# EAGLE design sensorboard_eurobotics2010_r2 (EAGLE 4.16)

## Sheet 1 of 2
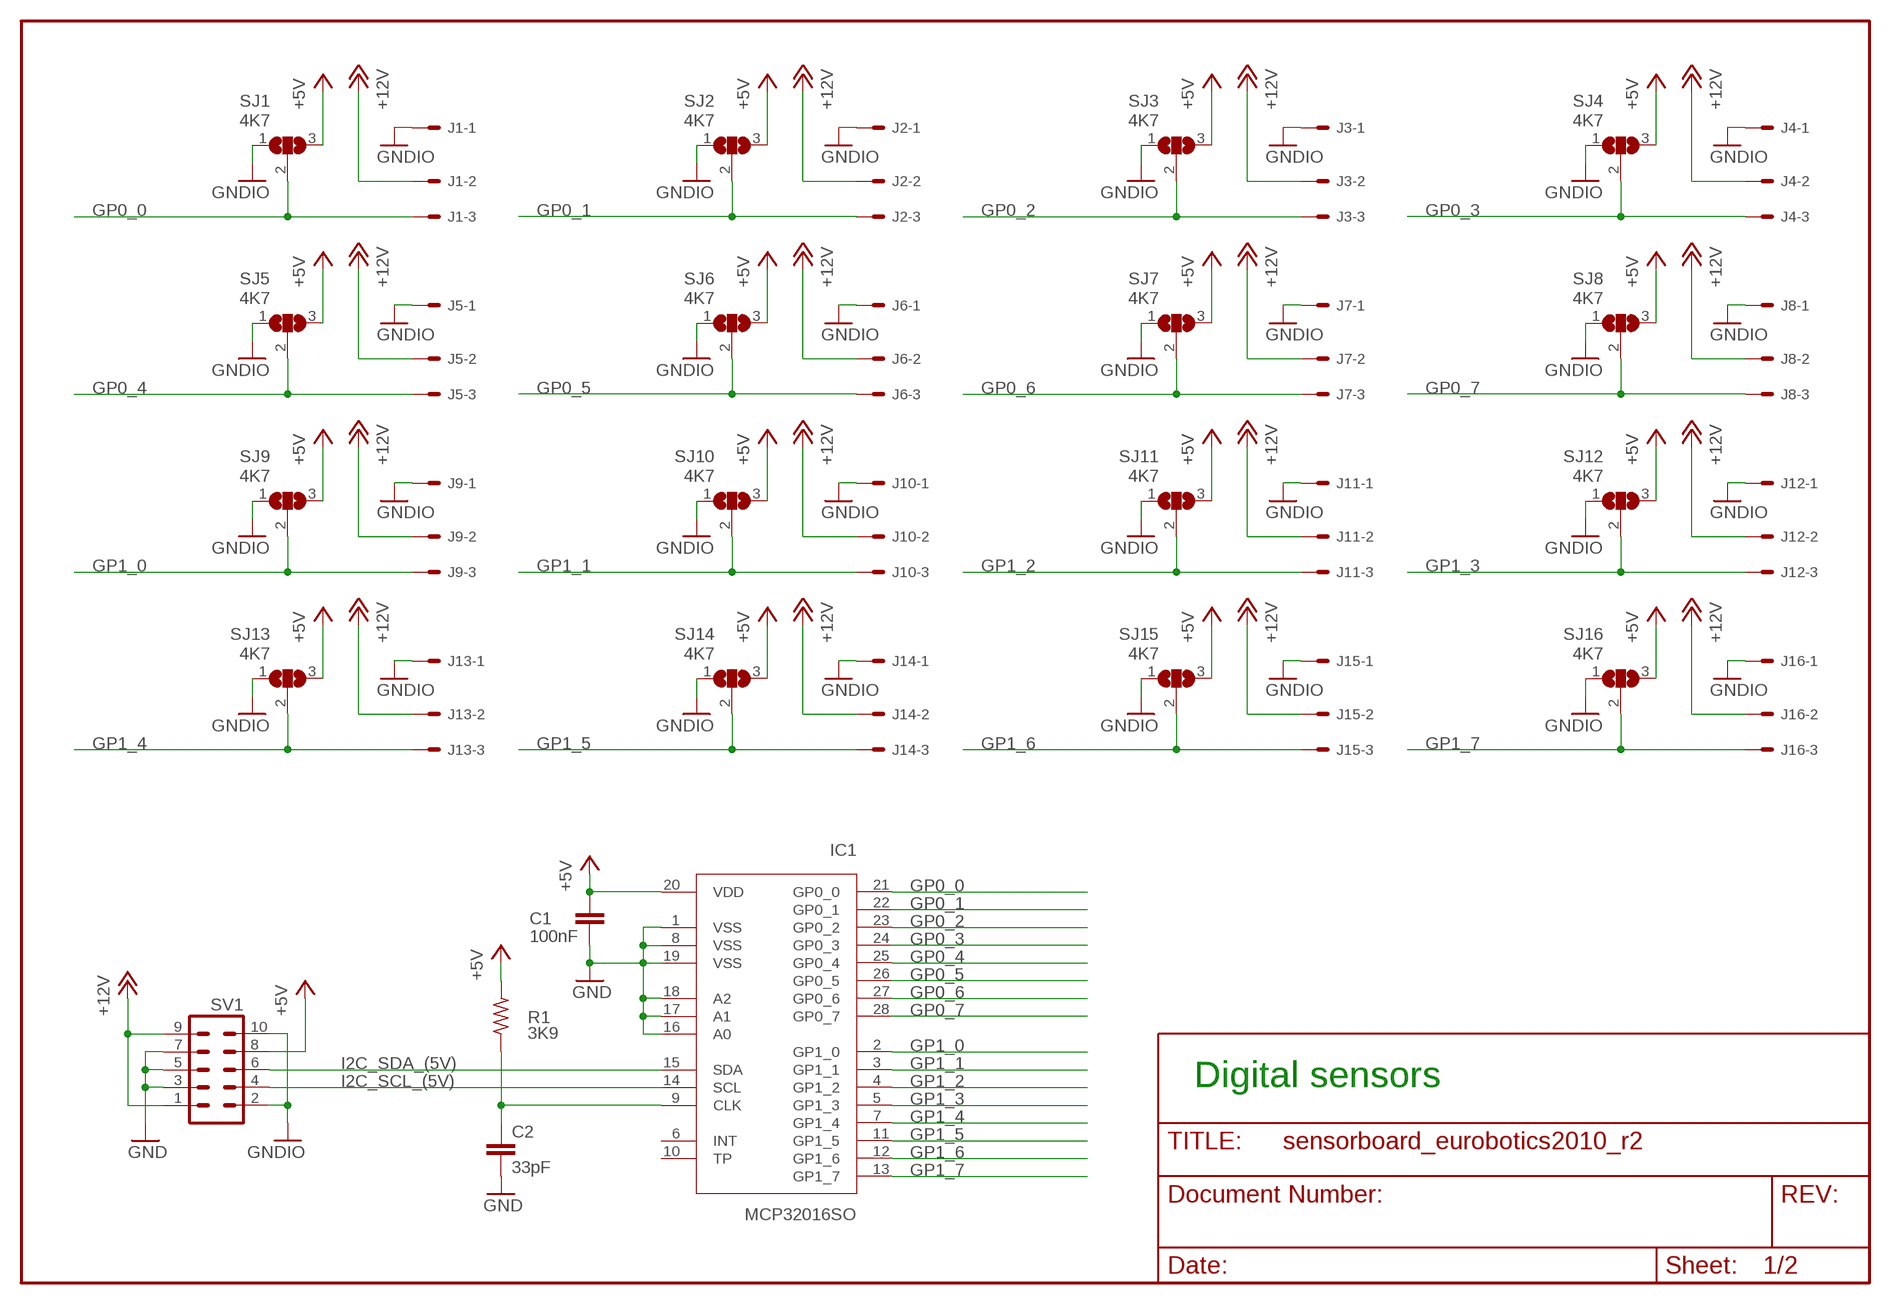
[diagram p0: schematic, sheet 1]

### Parts
C1  100nF  C-EUC0805  [C0805]
C2  33pF  C-EUC0805  [C0805]
IC1  MCP32016SO  [SO-28W]
J1  22-27-2031-03  [6410-03]
J2  22-27-2031-03  [6410-03]
J3  22-27-2031-03  [6410-03]
J4  22-27-2031-03  [6410-03]
J5  22-27-2031-03  [6410-03]
J6  22-27-2031-03  [6410-03]
J7  22-27-2031-03  [6410-03]
J8  22-27-2031-03  [6410-03]
J9  22-27-2031-03  [6410-03]
J10  22-27-2031-03  [6410-03]
J11  22-27-2031-03  [6410-03]
J12  22-27-2031-03  [6410-03]
J13  22-27-2031-03  [6410-03]
J14  22-27-2031-03  [6410-03]
J15  22-27-2031-03  [6410-03]
J16  22-27-2031-03  [6410-03]
R1  3K9  R-US_R0805  [R0805]
SJ1  4K7  SJ2W  [SJ_2]
SJ2  4K7  SJ2W  [SJ_2]
SJ3  4K7  SJ2W  [SJ_2]
SJ4  4K7  SJ2W  [SJ_2]
SJ5  4K7  SJ2W  [SJ_2]
SJ6  4K7  SJ2W  [SJ_2]
SJ7  4K7  SJ2W  [SJ_2]
SJ8  4K7  SJ2W  [SJ_2]
SJ9  4K7  SJ2W  [SJ_2]
SJ10  4K7  SJ2W  [SJ_2]
SJ11  4K7  SJ2W  [SJ_2]
SJ12  4K7  SJ2W  [SJ_2]
SJ13  4K7  SJ2W  [SJ_2]
SJ14  4K7  SJ2W  [SJ_2]
SJ15  4K7  SJ2W  [SJ_2]
SJ16  4K7  SJ2W  [SJ_2]
SV1  ML10  [ML10]

### Nets
+5V: C1.1 IC1.20(VDD) R1.2 SJ1.3 SJ2.3 SJ3.3 SJ4.3 SJ5.3 SJ6.3 SJ7.3 SJ8.3 SJ9.3 SJ10.3 SJ11.3 SJ12.3 SJ13.3 SJ14.3 SJ15.3 SJ16.3 SV1.8 ; also sheet 2
+12V: J1.2 J2.2 J3.2 J4.2 J5.2 J6.2 J7.2 J8.2 J9.2 J10.2 J11.2 J12.2 J13.2 J14.2 J15.2 J16.2 SV1.1 SV1.9 ; also sheet 2
GND: C1.2 C2.2 IC1.1(VSS) IC1.8(VSS) IC1.16(A0) IC1.17(A1) IC1.18(A2) IC1.19(VSS) SV1.3 SV1.5 SV1.7 ; also sheet 2
GNDIO: J1.1 J2.1 J3.1 J4.1 J5.1 J6.1 J7.1 J8.1 J9.1 J10.1 J11.1 J12.1 J13.1 J14.1 J15.1 J16.1 SJ1.1 SJ2.1 SJ3.1 SJ4.1 SJ5.1 SJ6.1 SJ7.1 SJ8.1 SJ9.1 SJ10.1 SJ11.1 SJ12.1 SJ13.1 SJ14.1 SJ15.1 SJ16.1 SV1.2 SV1.10 ; also sheet 2
GP0_0: IC1.21(GP0_0) J1.3 SJ1.2
GP0_1: IC1.22(GP0_1) J2.3 SJ2.2
GP0_2: IC1.23(GP0_2) J3.3 SJ3.2
GP0_3: IC1.24(GP0_3) J4.3 SJ4.2
GP0_4: IC1.25(GP0_4) J5.3 SJ5.2
GP0_5: IC1.26(GP0_5) J6.3 SJ6.2
GP0_6: IC1.27(GP0_6) J7.3 SJ7.2
GP0_7: IC1.28(GP0_7) J8.3 SJ8.2
GP1_0: IC1.2(GP1_0) J9.3 SJ9.2
GP1_1: IC1.3(GP1_1) J10.3 SJ10.2
GP1_2: IC1.4(GP1_2) J11.3 SJ11.2
GP1_3: IC1.5(GP1_3) J12.3 SJ12.2
GP1_4: IC1.7(GP1_4) J13.3 SJ13.2
GP1_5: IC1.11(GP1_5) J14.3 SJ14.2
GP1_6: IC1.12(GP1_6) J15.3 SJ15.2
GP1_7: IC1.13(GP1_7) J16.3 SJ16.2
I2C_SCL_(5V): IC1.14(SCL) SV1.4 ; also sheet 2
I2C_SDA_(5V): IC1.15(SDA) SV1.6 ; also sheet 2
N$63: C2.1 IC1.9(CLK) R1.1
Unconnected: IC1.6(INT) IC1.10(TP)

### Notes on the sheet
- Digital sensors

## Sheet 2 of 2
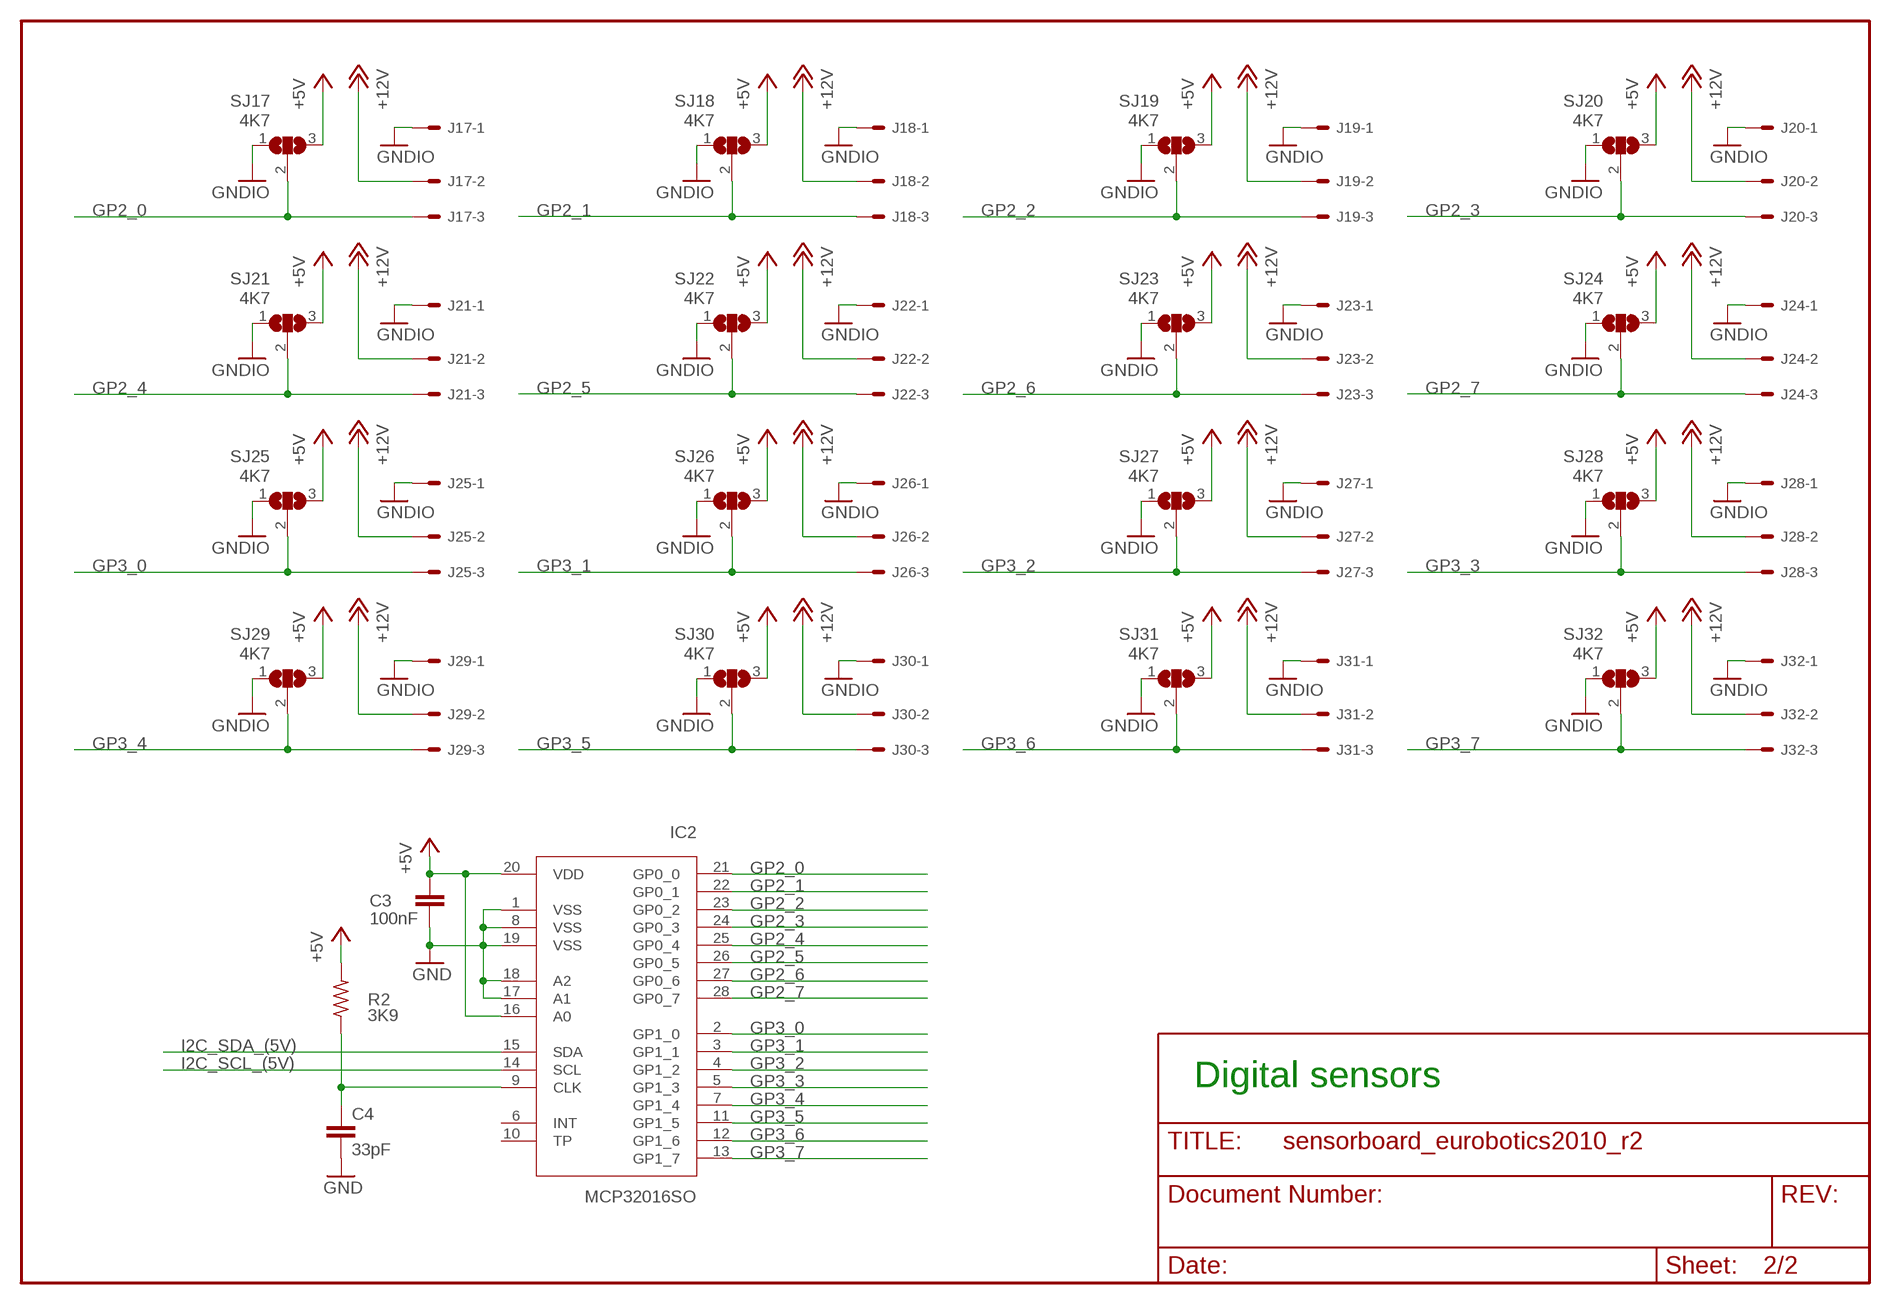
[diagram p1: schematic, sheet 2]

### Parts
C3  100nF  C-EUC0805  [C0805]
C4  33pF  C-EUC0805  [C0805]
IC2  MCP32016SO  [SO-28W]
J17  22-27-2031-03  [6410-03]
J18  22-27-2031-03  [6410-03]
J19  22-27-2031-03  [6410-03]
J20  22-27-2031-03  [6410-03]
J21  22-27-2031-03  [6410-03]
J22  22-27-2031-03  [6410-03]
J23  22-27-2031-03  [6410-03]
J24  22-27-2031-03  [6410-03]
J25  22-27-2031-03  [6410-03]
J26  22-27-2031-03  [6410-03]
J27  22-27-2031-03  [6410-03]
J28  22-27-2031-03  [6410-03]
J29  22-27-2031-03  [6410-03]
J30  22-27-2031-03  [6410-03]
J31  22-27-2031-03  [6410-03]
J32  22-27-2031-03  [6410-03]
R2  3K9  R-US_R0805  [R0805]
SJ17  4K7  SJ2W  [SJ_2]
SJ18  4K7  SJ2W  [SJ_2]
SJ19  4K7  SJ2W  [SJ_2]
SJ20  4K7  SJ2W  [SJ_2]
SJ21  4K7  SJ2W  [SJ_2]
SJ22  4K7  SJ2W  [SJ_2]
SJ23  4K7  SJ2W  [SJ_2]
SJ24  4K7  SJ2W  [SJ_2]
SJ25  4K7  SJ2W  [SJ_2]
SJ26  4K7  SJ2W  [SJ_2]
SJ27  4K7  SJ2W  [SJ_2]
SJ28  4K7  SJ2W  [SJ_2]
SJ29  4K7  SJ2W  [SJ_2]
SJ30  4K7  SJ2W  [SJ_2]
SJ31  4K7  SJ2W  [SJ_2]
SJ32  4K7  SJ2W  [SJ_2]

### Nets
+5V: C3.1 IC2.16(A0) IC2.20(VDD) R2.2 SJ17.3 SJ18.3 SJ19.3 SJ20.3 SJ21.3 SJ22.3 SJ23.3 SJ24.3 SJ25.3 SJ26.3 SJ27.3 SJ28.3 SJ29.3 SJ30.3 SJ31.3 SJ32.3 ; also sheet 1
+12V: J17.2 J18.2 J19.2 J20.2 J21.2 J22.2 J23.2 J24.2 J25.2 J26.2 J27.2 J28.2 J29.2 J30.2 J31.2 J32.2 ; also sheet 1
GND: C3.2 C4.2 IC2.1(VSS) IC2.8(VSS) IC2.17(A1) IC2.18(A2) IC2.19(VSS) ; also sheet 1
GNDIO: J17.1 J18.1 J19.1 J20.1 J21.1 J22.1 J23.1 J24.1 J25.1 J26.1 J27.1 J28.1 J29.1 J30.1 J31.1 J32.1 SJ17.1 SJ18.1 SJ19.1 SJ20.1 SJ21.1 SJ22.1 SJ23.1 SJ24.1 SJ25.1 SJ26.1 SJ27.1 SJ28.1 SJ29.1 SJ30.1 SJ31.1 SJ32.1 ; also sheet 1
GP2_0: IC2.21(GP0_0) J17.3 SJ17.2
GP2_1: IC2.22(GP0_1) J18.3 SJ18.2
GP2_2: IC2.23(GP0_2) J19.3 SJ19.2
GP2_3: IC2.24(GP0_3) J20.3 SJ20.2
GP2_4: IC2.25(GP0_4) J21.3 SJ21.2
GP2_5: IC2.26(GP0_5) J22.3 SJ22.2
GP2_6: IC2.27(GP0_6) J23.3 SJ23.2
GP2_7: IC2.28(GP0_7) J24.3 SJ24.2
GP3_0: IC2.2(GP1_0) J25.3 SJ25.2
GP3_1: IC2.3(GP1_1) J26.3 SJ26.2
GP3_2: IC2.4(GP1_2) J27.3 SJ27.2
GP3_3: IC2.5(GP1_3) J28.3 SJ28.2
GP3_4: IC2.7(GP1_4) J29.3 SJ29.2
GP3_5: IC2.11(GP1_5) J30.3 SJ30.2
GP3_6: IC2.12(GP1_6) J31.3 SJ31.2
GP3_7: IC2.13(GP1_7) J32.3 SJ32.2
I2C_SCL_(5V): IC2.14(SCL) ; also sheet 1
I2C_SDA_(5V): IC2.15(SDA) ; also sheet 1
N$2: C4.1 IC2.9(CLK) R2.1
Unconnected: IC2.6(INT) IC2.10(TP)

### Notes on the sheet
- Digital sensors

## Library data of the parts
C1-C4 = rcl:C-EU: CAPACITOR, European symbol
IC1 IC2 = eagle_jbs_lib:MCP32016: 16-Bit I2C I/O Expander
J1-J32 = con-molex:22-?-03: CONNECTOR wire to board 2.54 mm (.1 inch) pitch header
R1 R2 = rcl:R-US_: RESISTOR, American symbol
SJ1-SJ32 = jumper:SJ2W: SMD solder JUMPER
SV1 = con-harting-ml:ML10: HARTING

## Board
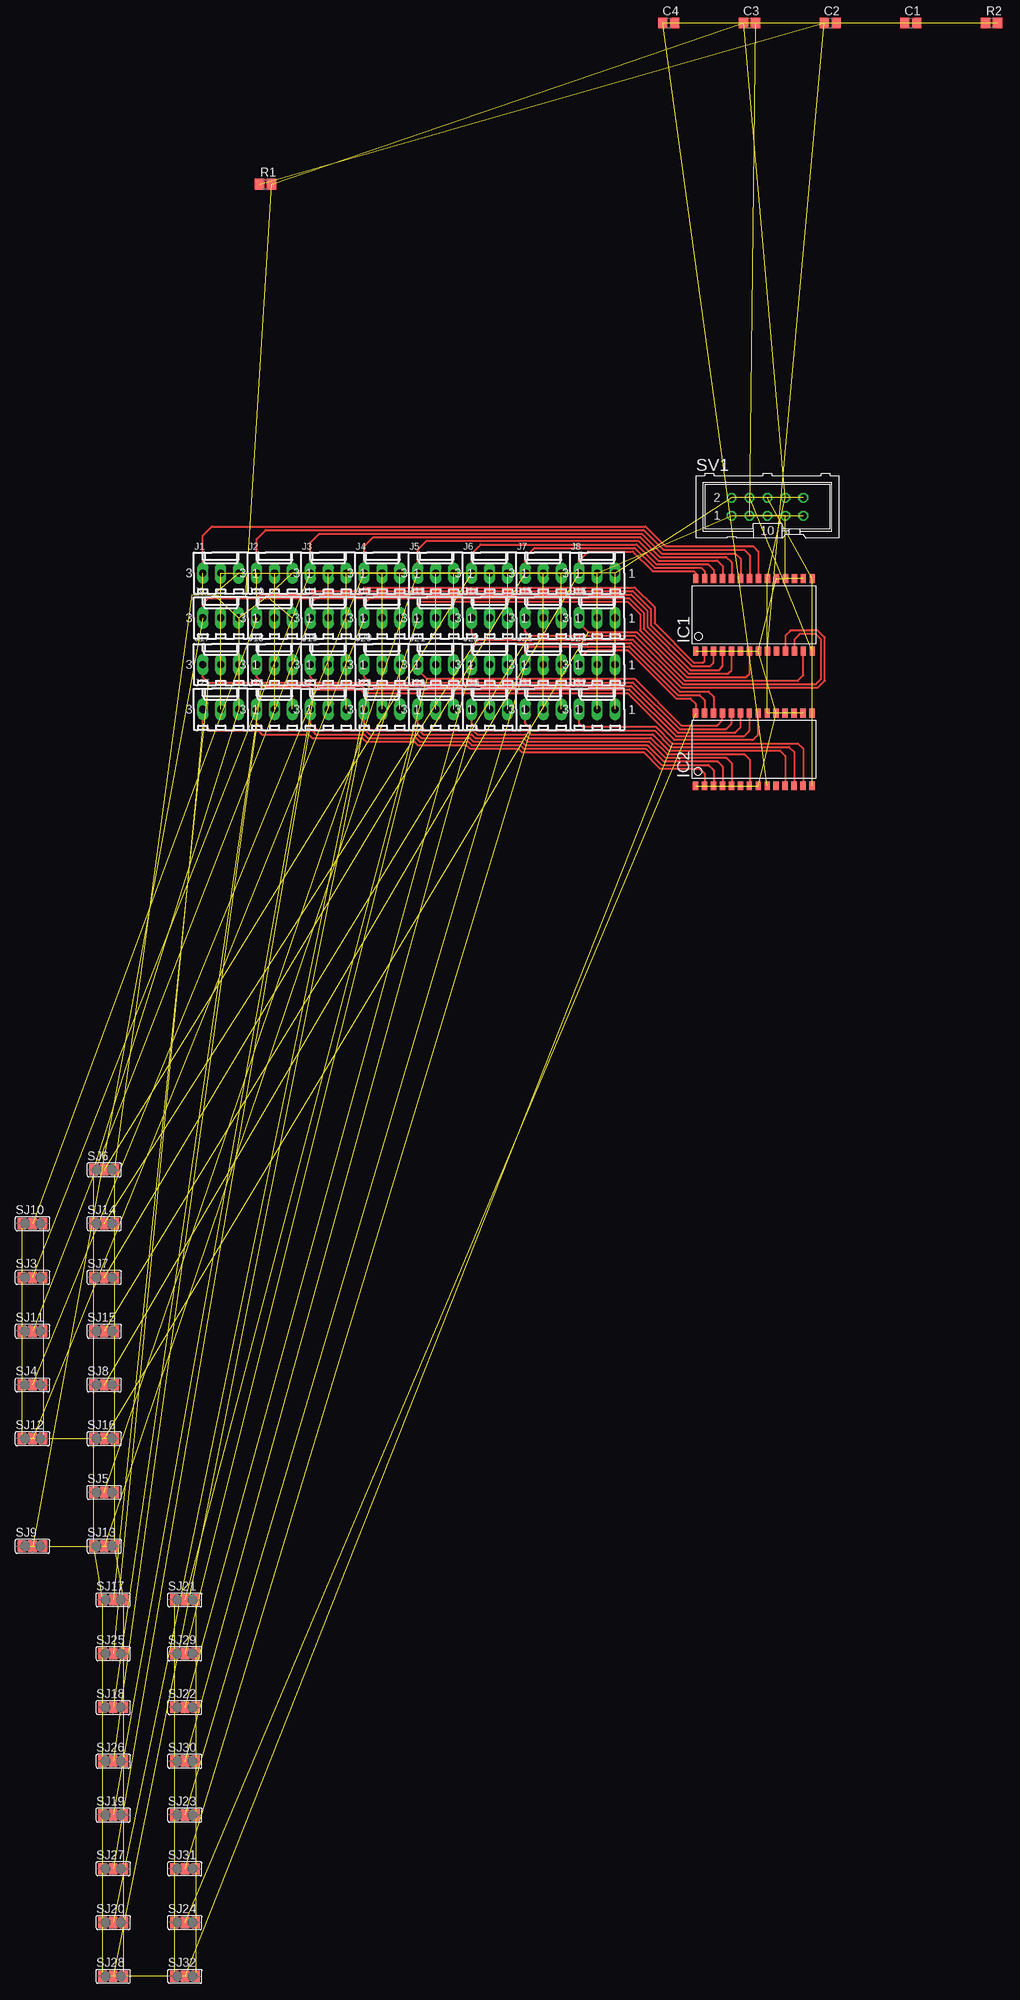
[diagram p2: board, top side]
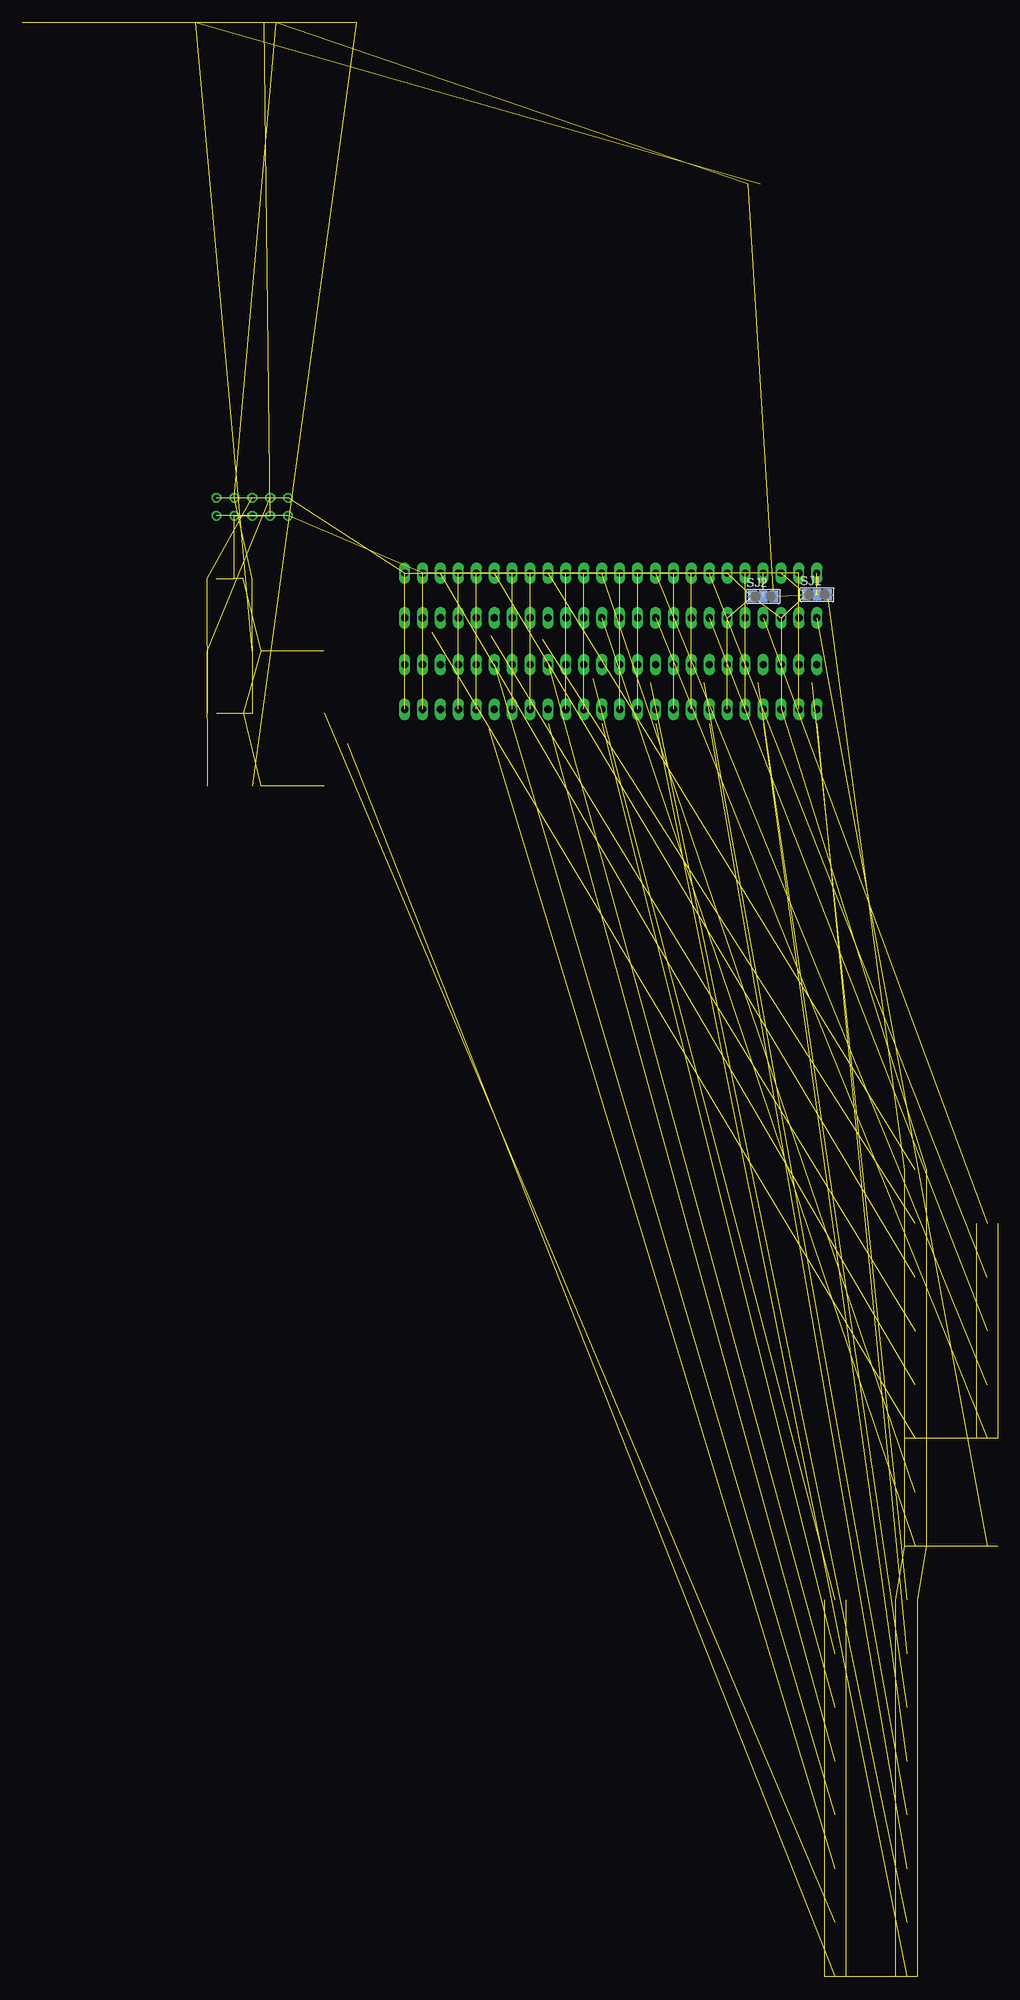
[diagram p3: board, bottom side, seen from below]

No outline drawn. Coordinates in mm, seen from the top.
Copper layers (1*16): Top 0.035mm / dielectric 1.5mm / Bottom 0.035mm
Design rules "olimex": minimum track width 10mil, minimum drill 24mil, track to track 8mil, track to pad 8mil, pad to pad 8mil, via to via 8mil, smd to smd 8mil, copper to edge 40mil, drill to drill 8mil, minimum pad ring 8mil, minimum via ring 8mil, stop-mask expansion 4mil, vias tented up to drill 0mil, thermal gap 10mil

### Footprints (pad centres in the part's own frame; a part is rotated, then mirrored left to right if it is on the bottom)
C0805 = smd 1.3 x 1.5: 1 -0.85,0; 2 0.85,0
SO-28W = smd 0.762 x 1.27: 1 -7.62,-5.207; 2 -6.35,-5.207; 3 -5.08,-5.207; 4 -3.81,-5.207; 5 -2.54,-5.207; 6 -1.27,-5.207; 7 0,-5.207; 8 1.27,-5.207; 9 2.54,-5.207; 10 3.81,-5.207; 11 5.08,-5.207; 12 6.35,-5.207; 13 7.62,-5.207; 14 8.89,-5.207; 15 8.89,5.08; 16 7.62,5.08; 17 6.35,5.08; 18 5.08,5.08; 19 3.81,5.08; 20 2.54,5.08; 21 1.27,5.08; 22 0,5.08; 23 -1.27,5.08; 24 -2.54,5.08; 25 -3.81,5.08; 26 -5.08,5.08; 27 -6.35,5.08; 28 -7.62,5.08
6410-03 = drill 1.016 long: 1 2.54,0; 2 0,0; 3 -2.54,0
R0805 = smd 1.3 x 1.5: 1 -0.85,0; 2 0.85,0
SJ_2 = smd 1.168 x 1.6: 1 -1.524,0; 2 0,0; 3 1.524,0
ML10 = drill 0.914 octagon: 1 -5.08,-1.27; 2 -5.08,1.27; 3 -2.54,-1.27; 4 -2.54,1.27; 5 0,-1.27; 6 0,1.27; 7 2.54,-1.27; 8 2.54,1.27; 9 5.08,-1.27; 10 5.08,1.27

### Placement (x,y rotation side)
C1  104.14,113.03 0 top
C2  92.71,113.03 0 top
C3  81.28,113.03 0 top
C4  69.85,113.03 0 top
IC1  81.28,29.21 0 top
IC2  81.25,10.11 0 top
J1  6.35,35.05 0 top
J2  13.97,35.05 0 top
J3  21.59,35.05 0 top
J4  29.21,35.05 0 top
J5  36.83,35.05 0 top
J6  44.45,35.05 0 top
J7  52.07,35.05 0 top
J8  59.69,35.05 0 top
J9  6.35,28.7 0 top
J10  13.97,28.7 0 top
J11  21.59,28.7 0 top
J12  29.21,28.7 0 top
J13  36.83,28.7 0 top
J14  44.45,28.7 0 top
J15  52.07,28.7 0 top
J16  59.69,28.7 0 top
J17  6.35,22.1 0 top
J18  13.97,22.1 0 top
J19  21.59,22.1 0 top
J20  29.21,22.1 0 top
J21  36.83,22.1 0 top
J22  44.45,22.1 0 top
J23  52.07,22.1 0 top
J24  59.69,22.1 0 top
J25  6.35,15.75 0 top
J26  13.97,15.75 0 top
J27  21.59,15.75 0 top
J28  29.21,15.75 0 top
J29  36.83,15.75 0 top
J30  44.45,15.75 0 top
J31  52.07,15.75 0 top
J32  59.69,15.75 0 top
R1  12.7,90.17 0 top
R2  115.57,113.03 0 top
SJ1  3.81,32 0 bottom
SJ2  11.43,31.75 0 bottom
SJ3  -20.32,-64.77 0 top
SJ4  -20.32,-80.01 0 top
SJ5  -10.16,-95.25 0 top
SJ6  -10.16,-49.53 0 top
SJ7  -10.16,-64.77 0 top
SJ8  -10.16,-80.01 0 top
SJ9  -20.32,-102.87 0 top
SJ10  -20.32,-57.15 0 top
SJ11  -20.32,-72.39 0 top
SJ12  -20.32,-87.63 0 top
SJ13  -10.16,-102.87 0 top
SJ14  -10.16,-57.15 0 top
SJ15  -10.16,-72.39 0 top
SJ16  -10.16,-87.63 0 top
SJ17  -8.89,-110.49 0 top
SJ18  -8.89,-125.73 0 top
SJ19  -8.89,-140.97 0 top
SJ20  -8.89,-156.21 0 top
SJ21  1.27,-110.49 0 top
SJ22  1.27,-125.73 0 top
SJ23  1.27,-140.97 0 top
SJ24  1.27,-156.21 0 top
SJ25  -8.89,-118.11 0 top
SJ26  -8.89,-133.35 0 top
SJ27  -8.89,-148.59 0 top
SJ28  -8.89,-163.83 0 top
SJ29  1.27,-118.11 0 top
SJ30  1.27,-133.35 0 top
SJ31  1.27,-148.59 0 top
SJ32  1.27,-163.83 0 top
SV1  83.82,44.45 0 top

### Tracks (layer width: path | path; a pad name or v marks a point on that pad's centre or on a via)
+5V  (39 unrouted)
+12V  (33 unrouted)
GND  (17 unrouted)
GNDIO  (65 unrouted)
GP0_0  (1 unrouted)
  Top 0.254: J1.3 3.81,40.39 5.08,41.66 66.55,41.66 69.34,38.86 81.79,38.86 82.55,38.1 IC1.21
GP0_1  (1 unrouted)
  Top 0.254: J2.3 11.43,39.88 12.7,41.15 66.29,41.15 69.09,38.35 80.52,38.35 81.28,37.59 IC1.22
GP0_2  (1 unrouted)
  Top 0.254: J3.3 19.05,39.37 20.32,40.64 66.04,40.64 68.83,37.85 79.25,37.85 80.01,37.08 IC1.23
GP0_3  (1 unrouted)
  Top 0.254: J4.3 26.67,38.86 27.94,40.13 65.79,40.13 68.58,37.34 77.98,37.34 78.74,36.58 IC1.24
GP0_4  (1 unrouted)
  Top 0.254: J5.3 34.29,38.35 35.56,39.62 65.53,39.62 68.33,36.83 76.71,36.83 77.47,36.07 IC1.25
GP0_5  (1 unrouted)
  Top 0.254: J6.3 41.91,37.85 43.18,39.12 65.28,39.12 68.07,36.32 75.44,36.32 76.2,35.56 IC1.26
GP0_6  (1 unrouted)
  Top 0.254: J7.3 49.53,37.34 50.8,38.61 65.02,38.61 67.82,35.81 74.42,35.81 74.93,35.31 IC1.27
GP0_7  (1 unrouted)
  Top 0.254: J8.3 57.15,36.83 58.42,38.1 64.77,38.1 67.56,35.31 73.41,35.31 73.66,35.05 IC1.28
GP1_0  (1 unrouted)
  Top 0.254: J9.3 3.81,30.73 4.57,31.5 11.43,31.5 11.94,32 18.8,32 19.3,32.51 26.16,32.51 26.67,33.02 65.02,33.02 67.82,30.23 67.82,27.94 73.41,22.35 74.68,22.35 74.93,22.61 IC1.2
GP1_1  (1 unrouted)
  Top 0.254: J10.3 11.43,30.73 12.19,31.5 19.05,31.5 19.56,32 26.42,32 26.92,32.51 64.77,32.51 67.31,29.97 67.31,27.69 73.15,21.84 75.69,21.84 76.2,22.35 IC1.3
GP1_2  (1 unrouted)
  Top 0.254: J11.3 19.05,30.73 19.81,31.5 26.67,31.5 27.18,32 64.52,32 66.8,29.72 66.8,27.43 72.9,21.34 76.96,21.34 77.47,21.84 IC1.4 77.47,24.13
GP1_3  (1 unrouted)
  Top 0.254: J12.3 26.67,30.73 27.43,31.5 64.26,31.5 66.29,29.46 66.29,27.18 72.64,20.83 78.23,20.83 78.74,21.34 IC1.5
GP1_4  (1 unrouted)
  Top 0.254: J13.3 34.29,30.48 34.8,30.99 64.01,30.99 65.79,29.21 65.79,26.92 72.39,20.32 80.77,20.32 81.28,20.83 IC1.7 81.28,24.13
GP1_5  (1 unrouted)
  Top 0.254: J14.3 41.91,26.42 42.67,25.65 64.77,25.65 71.63,18.8 90.93,18.8 91.95,19.81 91.95,25.91 90.93,26.92 87.12,26.92 86.36,26.16 IC1.11
GP1_6  (1 unrouted)
  Top 0.254: J15.3 49.53,26.67 50.04,26.16 65.02,26.16 71.88,19.3 90.68,19.3 91.44,20.07 91.44,25.65 90.68,26.42 88.39,26.42 87.63,25.65 IC1.12 87.63,23.88
GP1_7  (1 unrouted)
  Top 0.254: J16.3 57.15,27.94 58.42,26.67 65.28,26.67 72.14,19.81 88.14,19.81 88.9,20.57 IC1.13
GP2_0  (1 unrouted)
  Top 0.254: J17.3 3.81,20.32 4.57,19.56 11.43,19.56 11.94,19.05 18.8,19.05 19.3,18.54 26.16,18.54 26.67,18.03 64.01,18.03 70.61,11.43 81.79,11.43 82.55,12.19 82.55,14.99 82.35,15.19 | 82.35,15.19 82.3,15.24 | 82.35,15.19 IC2.21
GP2_1  (1 unrouted)
  Top 0.254: J18.3 11.43,20.32 12.19,19.56 19.05,19.56 19.56,19.05 26.42,19.05 26.92,18.54 64.26,18.54 70.87,11.94 80.52,11.94 81.28,12.7 81.28,15.24 81.25,15.21 IC2.22
GP2_2  (1 unrouted)
  Top 0.254: J19.3 19.05,20.32 19.81,19.56 26.67,19.56 27.18,19.05 64.52,19.05 71.12,12.45 79.25,12.45 80.01,13.21 80.01,15.24 79.98,15.21 IC2.23
GP2_3  (1 unrouted)
  Top 0.254: J20.3 26.67,20.32 27.43,19.56 64.77,19.56 71.37,12.95 77.98,12.95 78.74,13.72 78.74,14.99 78.71,15.02 IC2.24
GP2_4  (1 unrouted)
  Top 0.254: J21.3 34.29,21.34 35.56,20.07 65.02,20.07 71.63,13.46 76.71,13.46 77.44,14.19 IC2.25
GP2_5  (1 unrouted)
  Top 0.254: J22.3 41.91,24.38 42.67,25.15 64.52,25.15 71.37,18.29 75.44,18.29 76.2,17.53 76.2,15.24 76.17,15.21 IC2.26
GP2_6  (1 unrouted)
  Top 0.254: J23.3 49.53,24.13 50.04,24.64 64.26,24.64 71.12,17.78 74.17,17.78 74.93,17.02 74.93,15.24 74.9,15.21 IC2.27
GP2_7  (1 unrouted)
  Top 0.254: J24.3 57.15,22.86 58.42,24.13 64.01,24.13 70.87,17.27 72.9,17.27 73.63,16.54 IC2.28
GP3_0  (1 unrouted)
  Top 0.254: J25.3 3.81,13.72 4.83,12.7 11.68,12.7 12.19,12.19 18.8,12.19 19.3,11.68 26.42,11.68 26.92,11.18 33.78,11.18 34.29,10.67 41.15,10.67 41.66,10.16 48.51,10.16 49.02,9.65 66.29,9.65 68.58,7.37 74.17,7.37 74.93,6.6 74.93,5.08 74.9,5.05 IC2.2
GP3_1  (1 unrouted)
  Top 0.254: J26.3 11.43,13.72 12.45,12.7 19.3,12.7 19.81,12.19 26.67,12.19 27.18,11.68 34.04,11.68 34.54,11.18 41.4,11.18 41.91,10.67 48.77,10.67 49.28,10.16 66.55,10.16 68.83,7.87 75.44,7.87 76.2,7.11 76.2,5.08 76.17,5.05 IC2.3
GP3_2  (1 unrouted)
  Top 0.254: J27.3 19.05,13.72 20.07,12.7 26.92,12.7 27.43,12.19 34.29,12.19 34.8,11.68 41.66,11.68 42.16,11.18 49.02,11.18 49.53,10.67 66.8,10.67 69.09,8.38 76.71,8.38 77.47,7.62 77.47,5.08 77.44,5.05 IC2.4
GP3_3  (1 unrouted)
  Top 0.254: J28.3 26.67,13.72 27.69,12.7 34.54,12.7 35.05,12.19 41.91,12.19 42.42,11.68 49.28,11.68 49.78,11.18 67.06,11.18 69.34,8.89 77.98,8.89 78.74,8.13 78.74,4.83 78.71,4.86 IC2.5
GP3_4  (1 unrouted)
  Top 0.254: J29.3 34.29,13.72 35.31,12.7 42.16,12.7 42.67,12.19 49.53,12.19 50.04,11.68 67.31,11.68 69.6,9.4 80.52,9.4 81.28,8.64 81.28,5.08 81.25,5.05 IC2.7
GP3_5  (1 unrouted)
  Top 0.254: J30.3 41.91,13.72 42.93,12.7 49.78,12.7 50.29,12.19 67.56,12.19 69.85,9.91 85.6,9.91 86.36,9.14 86.36,5.08 86.33,5.05 IC2.11
GP3_6  (1 unrouted)
  Top 0.254: J31.3 49.53,13.72 50.29,12.95 50.55,12.7 67.82,12.7 70.1,10.41 86.87,10.41 87.63,9.65 87.63,5.08 87.6,5.05 IC2.12
GP3_7  (1 unrouted)
  Top 0.254: J32.3 57.15,13.72 57.66,13.21 68.07,13.21 70.36,10.92 88.14,10.92 88.9,10.16 88.9,5.08 88.87,5.05 IC2.13
I2C_SCL_(5V)  (2 unrouted)
I2C_SDA_(5V)  (2 unrouted)
N$2  (2 unrouted)
N$63  (2 unrouted)